# Altium schematic sheet 00.LemonAutopilot_0.SchDoc
size A4
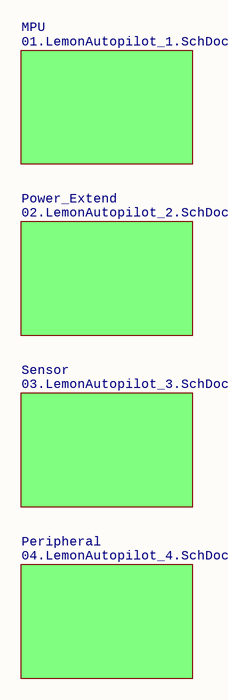
[diagram p0: 00.LemonAutopilot_0.SchDoc]

## Sub-sheets
MPU = 01.LemonAutopilot_1.SchDoc: no entries
Peripheral = 04.LemonAutopilot_4.SchDoc: no entries
Power_Extend = 02.LemonAutopilot_2.SchDoc: no entries
Sensor = 03.LemonAutopilot_3.SchDoc: no entries